# Altium schematic sheet BLOCK1.SchDoc
size A4; SheetNumber: 4; SheetTotal: 5
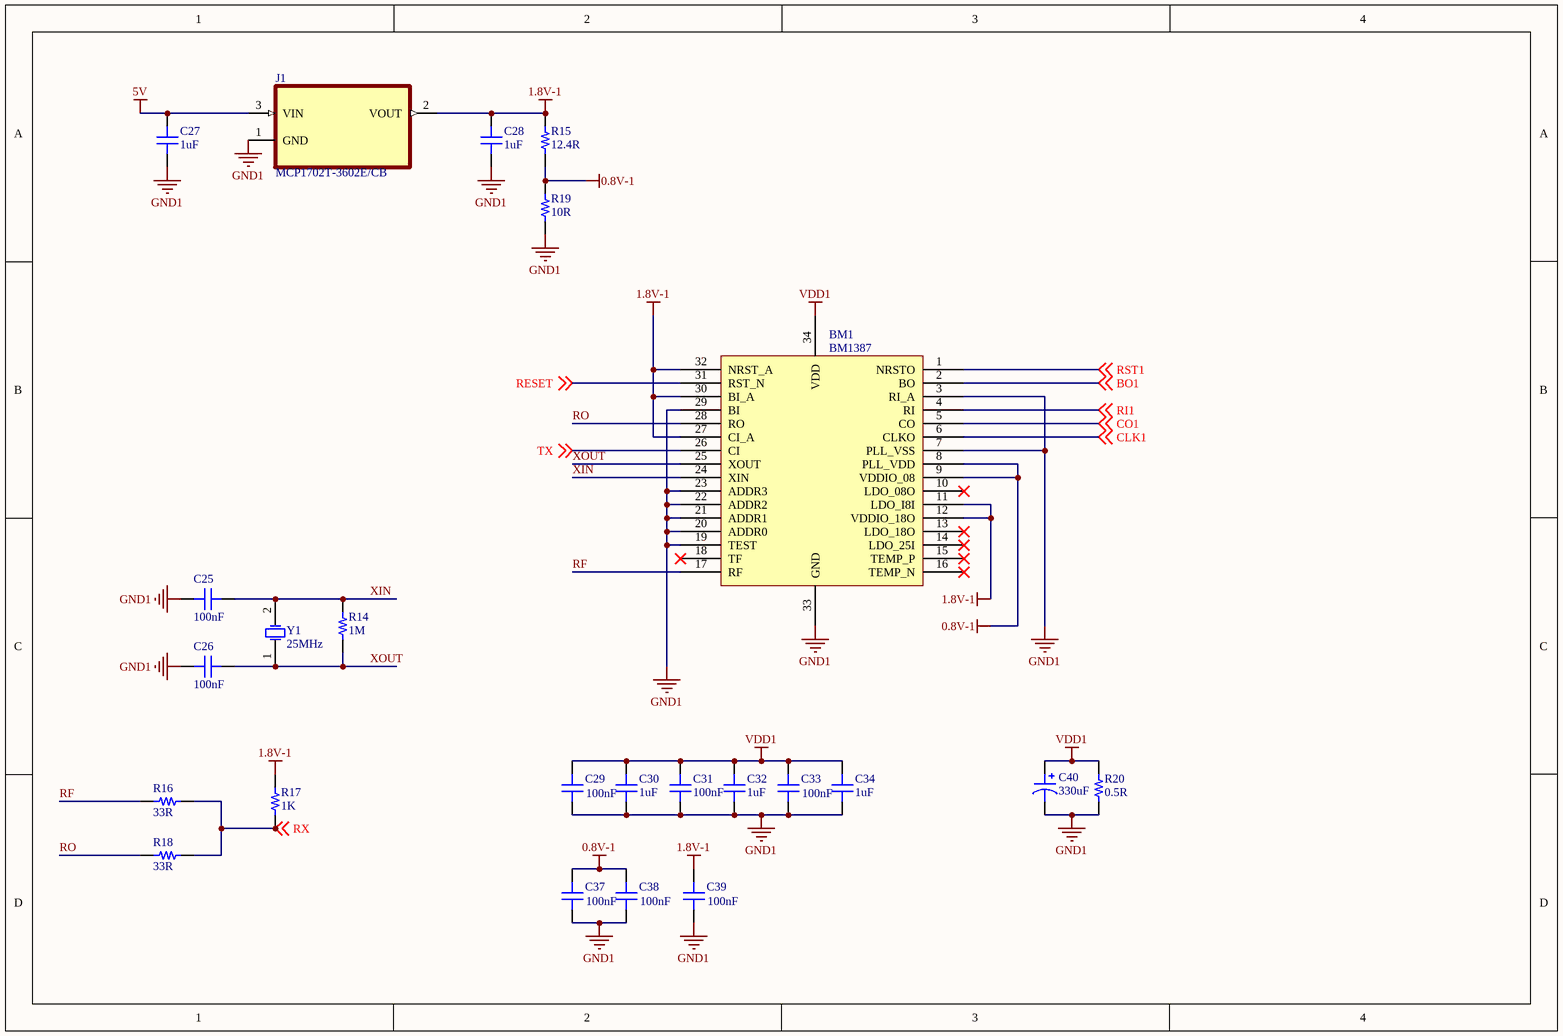
[diagram p0: BLOCK1.SchDoc]

## Parts
BM1  BM1387  [BM1387]
C25  100nF  [CAP-SMD-0402]
C26  100nF  [CAP-SMD-0402]
C27  1uF  [CAP-SMD-0402]
C28  1uF  [CAP-SMD-0402]
C29  100nF  [CAP_SMD_1206]
C30  1uF  [CAP_SMD_1206]
C31  100nF  [CAP_SMD_1206]
C32  1uF  [CAP_SMD_1206]
C33  100nF  [CAP_SMD_1206]
C34  1uF  [CAP_SMD_1206]
C37  100nF  [CAP-SMD-0402]
C38  100nF  [CAP-SMD-0402]
C39  100nF  [CAP-SMD-0402]
C40  330uF  [CAP-TAN-CASE-E]
J1  MCP1702T-3602E/CB  [SOT95P255X145-3N]
R14  1M  [RES-SMD-0402]
R15  12.4R  [RES-SMD-0402]
R16  33R  [RES-SMD-0402]
R17  1K  [RES-SMD-0402]
R18  33R  [RES-SMD-0402]
R19  10R  [RES-SMD-0402]
R20  0.5R  [RES-SMD-1206]
Y1  25MHz  [XTALL]

## Nets
0.8V-1: BM1.8(PLL_VDD) BM1.9(VDDIO_08) C37.2 C38.2 R15.1 R19.2
1.8V-1: BM1.11(LDO_I8I) BM1.12(VDDIO_18O) BM1.27(CI_A) BM1.30(BI_A) BM1.32(NRST_A) C28.2 C39.2 J1.2(VOUT) R15.2 R17.2
5V: C27.2 J1.3(VIN)
GND1: BM1.3(RI_A) BM1.7(PLL_VSS) BM1.19(TEST) BM1.20(ADDR0) BM1.21(ADDR1) BM1.22(ADDR2) BM1.23(ADDR3) BM1.29(BI) BM1.33(GND) C25.1 C26.1 C27.1 C28.1 C29.1 C30.1 C31.1 C32.1 C33.1 C34.1 C37.1 C38.1 C39.1 C40.2 J1.1(GND) R19.1 R20.1
VDD1: BM1.34(VDD) C29.2 C30.2 C31.2 C32.2 C33.2 C34.2 C40.1 R20.2
BO1: BM1.2(BO) ; off-sheet BO1
CLK1: BM1.6(CLKO) ; off-sheet CLK1
CO1: BM1.5(CO) ; off-sheet CO1
RESET: BM1.31(RST_N) ; off-sheet RESET
RF: BM1.17(RF) R16.1
RI1: BM1.4(RI) ; off-sheet RI1
RO: BM1.28(RO) R18.1
RST1: BM1.1(NRSTO) ; off-sheet RST1
RX: R16.2 R17.1 R18.2 ; off-sheet RX
TX: BM1.26(CI) ; off-sheet TX
XIN: BM1.24(XIN) C25.2 R14.2 Y1.2(OSC2)
XOUT: BM1.25(XOUT) C26.2 R14.1 Y1.1(OSC1)

Not connected (* = marked no-connect by the designer): BM1 10(LDO_08O)* 13(LDO_18O)* 14(LDO_25I)* 15(TEMP_P)* 16(TEMP_N)* 18(TF)*

## Library data of the parts
C25-C34 C37-C39 = CAP
C40 = POLARIZED CAP
J1 = MCP1702T-3602E/CB: 250 mA Low Quiescent Current LDO Regulator; Package: None; Price: None; Value: *; MP: MCP1702T-3602E/CB; Availability: Unavailable
R14-R20 = RES
Y1 = XTAL: Crystal Oscillator; Published: 8-Jun-2000; LatestRevisionDate: 17-Jul-2002; LatestRevisionNote: Re-released for DXP Platform.; PackageReference: R38; Publisher: Altium Limited; PackageDescription: Crystal, Thru-Hole; 2 Leads; Body 3.1 x 8.2 mm (Dia.xH); Value: 25MHz